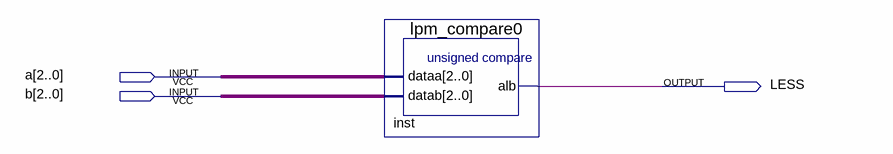
[diagram p0: schematic sheet]
// Quartus schematic LAB_3.bdf as structural Verilog: 1 symbols, 3 pins
module LAB_3 (
  input  [2:0] a,
  input  [2:0] b,
  output LESS
);

  lpm_compare0 inst (.dataa(a), .datab(b), .alb(LESS));
endmodule
